# EAGLE design RC-SD2IEC_DJV (EAGLE 6.6.0)
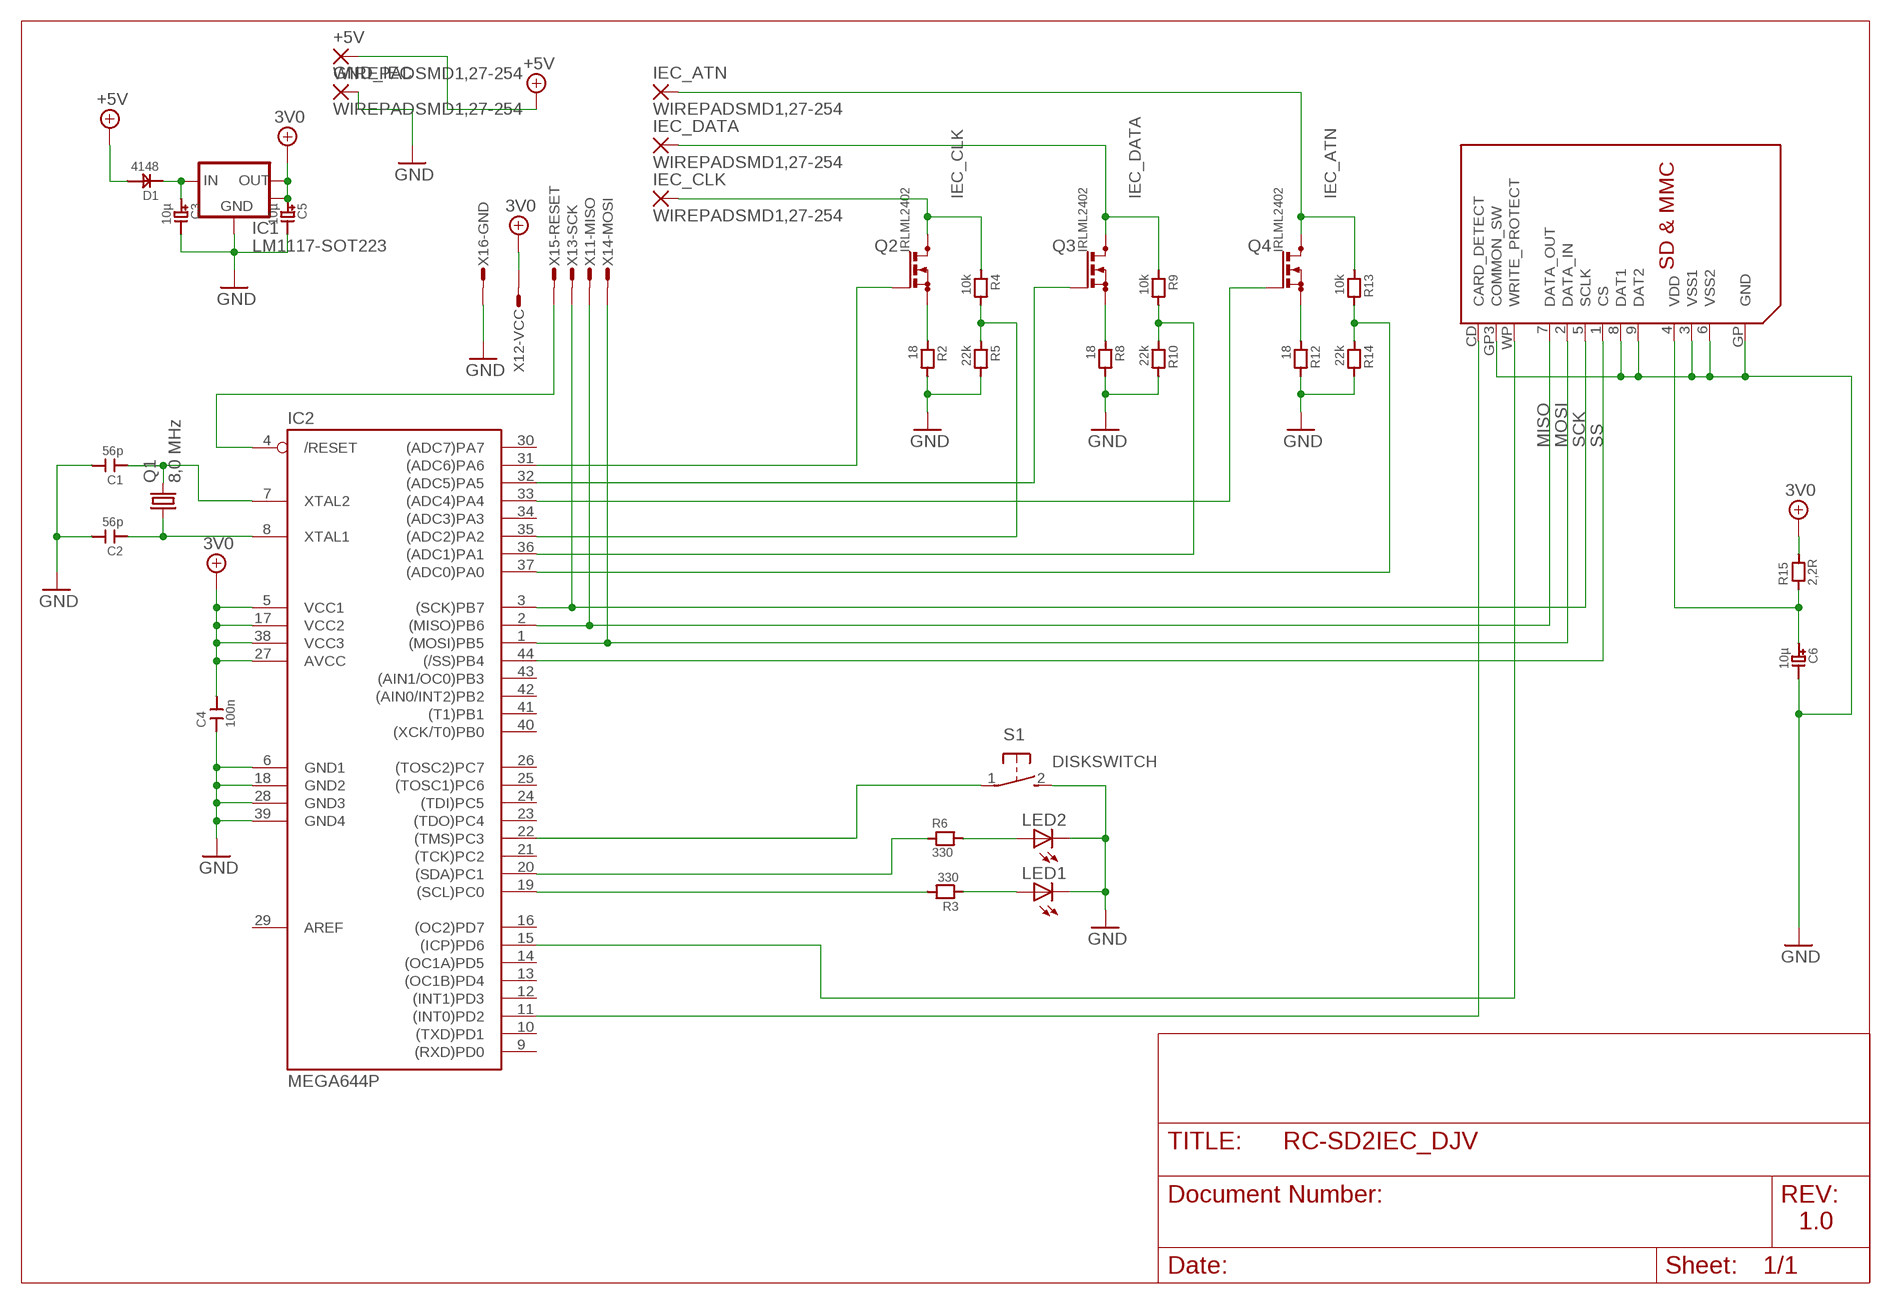
[diagram p0: schematic, sheet 1]

## Parts
+5V  WIREPADSMD1,27-254  [SMD1,27-2,54]
C1  56p  C0805  [C0805]
C2  56p  C0805  [C0805]
C3  10µ  C_POLTA_A  [C_TANTAL_A]
C4  100n  C1206  [C1206]
C5  10µ  C_POLTA_A  [C_TANTAL_A]
C6  10µ  C_POLTA_A  [C_TANTAL_A]
D1  4148  DSOD-123  [SOD-123]
GND_IEC  WIREPADSMD1,27-254  [SMD1,27-2,54]
IC1  LM1117-SOT223  [SOT-223-3]
IC2  MEGA644P  MEGA16/32TQFP  [TQFP44]
IEC_ATN  WIREPADSMD1,27-254  [SMD1,27-2,54]
IEC_CLK  WIREPADSMD1,27-254  [SMD1,27-2,54]
IEC_DATA  WIREPADSMD1,27-254  [SMD1,27-2,54]
LED1  LED3MM  [LED3MM]
LED2  LED3MM  [LED3MM]
Q1  8,0 MHz  CRYSTALCTS406  [CTS406]
Q2  IRLML2402  BSN20_C  [SOT23_C]
Q3  IRLML2402  BSN20_C  [SOT23_C]
Q4  IRLML2402  BSN20_C  [SOT23_C]
R2  18  R0805  [R0805]
R3  330  R0805  [R0805]
R4  10k  R0805  [R0805]
R5  22k  R0805  [R0805]
R6  330  R0805  [R0805]
R8  18  R0805  [R0805]
R9  10k  R0805  [R0805]
R10  22k  R0805  [R0805]
R12  18  R0805  [R0805]
R13  10k  R0805  [R0805]
R14  22k  R0805  [R0805]
R15  2,2R  R0805  [R0805]
S1  31-XX  [B3F-31XX]
SDMMC1  SDMMC06132  [06132]
X1  AVR-ISP_1X6  [1X6_ISP]

## Nets
3V0: C4.2 C5.1 IC1.2(VOUT) IC1.4(HEATSINK) IC2.5(VCC1) IC2.17(VCC2) IC2.27(AVCC) IC2.38(VCC3) R15.2 X1.2
+5V: +5V.1(P) D1.2
/RESET: IC2.4(/RESET) X1.5
ATN: IC2.37((ADC0)PA0) R13.2 R14.1
CD: IC2.11((INT0)PD2) SDMMC1.CD(CARD_DETECT)
CLK: IC2.35((ADC2)PA2) R4.2 R5.1
DATA: IC2.36((ADC1)PA1) R9.2 R10.1
DISKSWITCH: IC2.22((TMS)PC3) S1.1(P)
GND: C1.2 C2.2 C3.2 C4.1 C5.2 C6.2 GND_IEC.1(P) IC1.1(GND) IC2.6(GND1) IC2.18(GND2) IC2.28(GND3) IC2.39(GND4) LED1.K(C) LED2.K(C) R2.2 R5.2 R8.2 R10.2 R12.2 R14.2 S1.2(S) SDMMC1.3(VSS1) SDMMC1.6(VSS2) SDMMC1.8(DAT1) SDMMC1.9(DAT2) SDMMC1.GP3(COMMON_SW) SDMMC1.GP(GND) X1.6
IEC_ATN: IEC_ATN.1(P) Q4.3(D) R13.1
IEC_CLK: IEC_CLK.1(P) Q2.3(D) R4.1
IEC_DATA: IEC_DATA.1(P) Q3.3(D) R9.1
LED1: LED2.A R6.2
LED2: LED1.A R3.1
MISO: IC2.2((MISO)PB6) SDMMC1.7(DATA_OUT) X1.1
MOSI: IC2.1((MOSI)PB5) SDMMC1.2(DATA_IN) X1.4
N$2: C3.1 D1.1 IC1.3(VIN)
N$4: C2.1 IC2.8(XTAL1) Q1.1
N$5: C1.1 IC2.7(XTAL2) Q1.3
N$17: IC2.32((ADC5)PA5) Q3.1(G)
N$19: IC2.33((ADC4)PA4) Q4.1(G)
N$20: IC2.31((ADC6)PA6) Q2.1(G)
N$23: Q2.2(S) R2.1
N$24: Q3.2(S) R8.1
N$25: Q4.2(S) R12.1
PC0: IC2.19((SCL)PC0) R3.2
PC1: IC2.20((SDA)PC1) R6.1
SCK: IC2.3((SCK)PB7) SDMMC1.5(SCLK) X1.3
SS: IC2.44((/SS)PB4) SDMMC1.1(CS)
VDD: C6.1 R15.1 SDMMC1.4(VDD)
WP: IC2.15((ICP)PD6) SDMMC1.WP(WRITE_PROTECT)
Unconnected: IC2.9((RXD)PD0) IC2.10((TXD)PD1) IC2.12((INT1)PD3) IC2.13((OC1B)PD4) IC2.14((OC1A)PD5) IC2.16((OC2)PD7) IC2.21((TCK)PC2) IC2.23((TDO)PC4) IC2.24((TDI)PC5) IC2.25((TOSC1)PC6) IC2.26((TOSC2)PC7) IC2.29(AREF) IC2.30((ADC7)PA7) IC2.34((ADC3)PA3) IC2.40((XCK/T0)PB0) IC2.41((T1)PB1) IC2.42((AIN0/INT2)PB2) IC2.43((AIN1/OC0)PB3)

## Notes on the sheet
- 1.0

## Library data of the parts
+5V GND_IEC IEC_ATN IEC_CLK IEC_DATA = wirepad:WIREPAD: Wire PAD connect wire on PCB
C1 C2 C4 = 0_rr:C
C3 C5 C6 = 0_rr:C_POL
D1 = 0_rr:D
IC1 = bt_regulator:LM1117: LDO Voltage Regulator NCP1117 series are low dropout positive voltage regulators that are capable of providing an output current that is in excess of 1.0 A with a maximum dropout voltage of 1.2 V at 800 mA over temperature. This series contains nine fixed output voltages of 1.5 V, 1.8 V, 1.9 V, 2.0 V, 2.5 V, 2.85 V, 3.3 V, 5.0 V, and 12 V that have no minimum load requirement to maintain regulation. Also included is an adjustable output version that can be programmed from 1.25 V to 18.8 V with two external resistors. datasheet.pdf <http://www.onsemi.com/pub_link/Collateral/NCP1117-D.PDF> LM1117-N is a series of low dropout voltage regulators of 1.2V at 800mA of load current. It has the same pin-out as Texas Instruments' industry standard LM317. The LM1117-N is available in an adjustable version, available in five fixed voltages, 1.8V, 2.5V, 2.85V, 3.3V, and 5V. The LM1117-N offers current limiting and thermal shutdown. Its circuit includes a zener trimmed to within ±1%. datasheet.pdf <http://www.ti.com/lit/ds/symlink/lm1117-n.pdf>
IC2 = 0_rr:MEGA16/32: MICROCONTROLLER 16 Kbytes FLASH, 512 bytes EEPROM 1 Kbytes SRAM dual UART hardware multiplier
LED1 LED2 = led:LED: LED OSRAM: - CHIPLED LG R971, LG N971, LY N971, LG Q971, LY Q971, LO R971, LY R971 LH N974, LH R974 LS Q976, LO Q976, LY Q976 LO Q996 - Hyper CHIPLED LW Q18S LB Q993, LB Q99A, LB R99A - SideLED LS A670, LO A670, LY A670, LG A670, LP A670 LB A673, LV A673, LT A673, LW A673 LH A674 LY A675 LS A676, LA A676, LO A676, LY A676, LW A676 LS A679, LY A679, LG A679 - Hyper Micro SIDELED® LS Y876, LA Y876, LO Y876, LY Y876 LT Y87S - SmartLED LW L88C, LW L88S LB L89C, LB L89S, LG L890 LS L89K, LO L89K, LY L89K LS L896, LA L896, LO L896, LY L896 - TOPLED LS T670, LO T670, LY T670, LG T670, LP T670 LSG T670, LSP T670, LSY T670, LOP T670, LYG T670 LG T671, LOG T671, LSG T671 LB T673, LV T673, LT T673, LW T673 LH T674 LS T676, LA T676, LO T676, LY T676, LB T676, LH T676, LSB T676, LW T676 LB T67C, LV T67C, LT T67C, LS T67K, LO T67K, LY T67K, LW E67C LS E67B, LA E67B, LO E67B, LY E67B, LB E67C, LV E67C, LT E67C LW T67C LS T679, LY T679, LG T679 LS T770, LO T770, LY T770, LG T770, LP T770 LB T773, LV T773, LT T773, LW T773 LH T774 LS E675, LA E675, LY E675, LS T675 LS T776, LA T776, LO T776, LY T776, LB T776 LHGB T686 LT T68C, LB T68C - Hyper Mini TOPLED® LB M676 - Mini TOPLED Santana® LG M470 LS M47K, LO M47K, LY M47K Source: http://www.osram.convergy.de LUXEON: - LUMILED® LXK2-PW12-R00, LXK2-PW12-S00, LXK2-PW14-U00, LXK2-PW14-V00 LXK2-PM12-R00, LXK2-PM12-S00, LXK2-PM14-U00 LXK2-PE12-Q00, LXK2-PE12-R00, LXK2-PE12-S00, LXK2-PE14-T00, LXK2-PE14-U00 LXK2-PB12-K00, LXK2-PB12-L00, LXK2-PB12-M00, LXK2-PB14-N00, LXK2-PB14-P00, LXK2-PB14-Q00 LXK2-PR12-L00, LXK2-PR12-M00, LXK2-PR14-Q00, LXK2-PR14-R00 LXK2-PD12-Q00, LXK2-PD12-R00, LXK2-PD12-S00 LXK2-PH12-R00, LXK2-PH12-S00 LXK2-PL12-P00, LXK2-PL12-Q00, LXK2-PL12-R00 Source: www.luxeon.com KINGBRIGHT: KA-3528ASYC Source: www.kingbright.com
Q1 = adafruit:CRYSTAL: CRYSTAL; OC_FARNELL: unknown; OC_NEWARK: unknown
Q2-Q4 = 0_rr:BSN20: N-CHANNEL MOS FET
R2-R6 R8-R10 R12-R15 = 0_rr:R
S1 = switch-omron:31-XX: OMRON SWITCH
SDMMC1 = adafruit:SDMMC: SD MMC Card holder 4UCON part #06132 - easy to solder
X1 = 0_rr:AVR-ISP: MicroMaTch 6 7-215464-6 / 0-215464-6 Drawing Number C-215464 DDEController.pdf

## Board
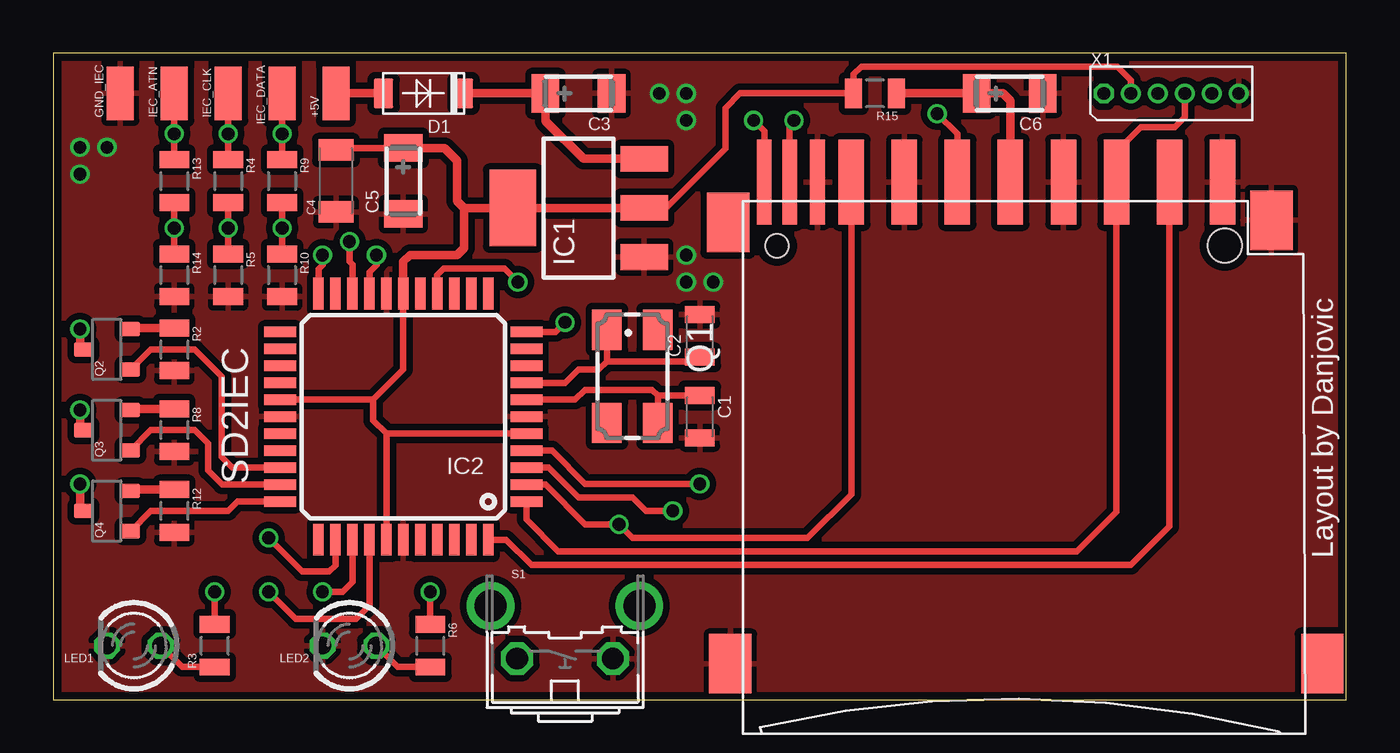
[diagram p1: board, top side]
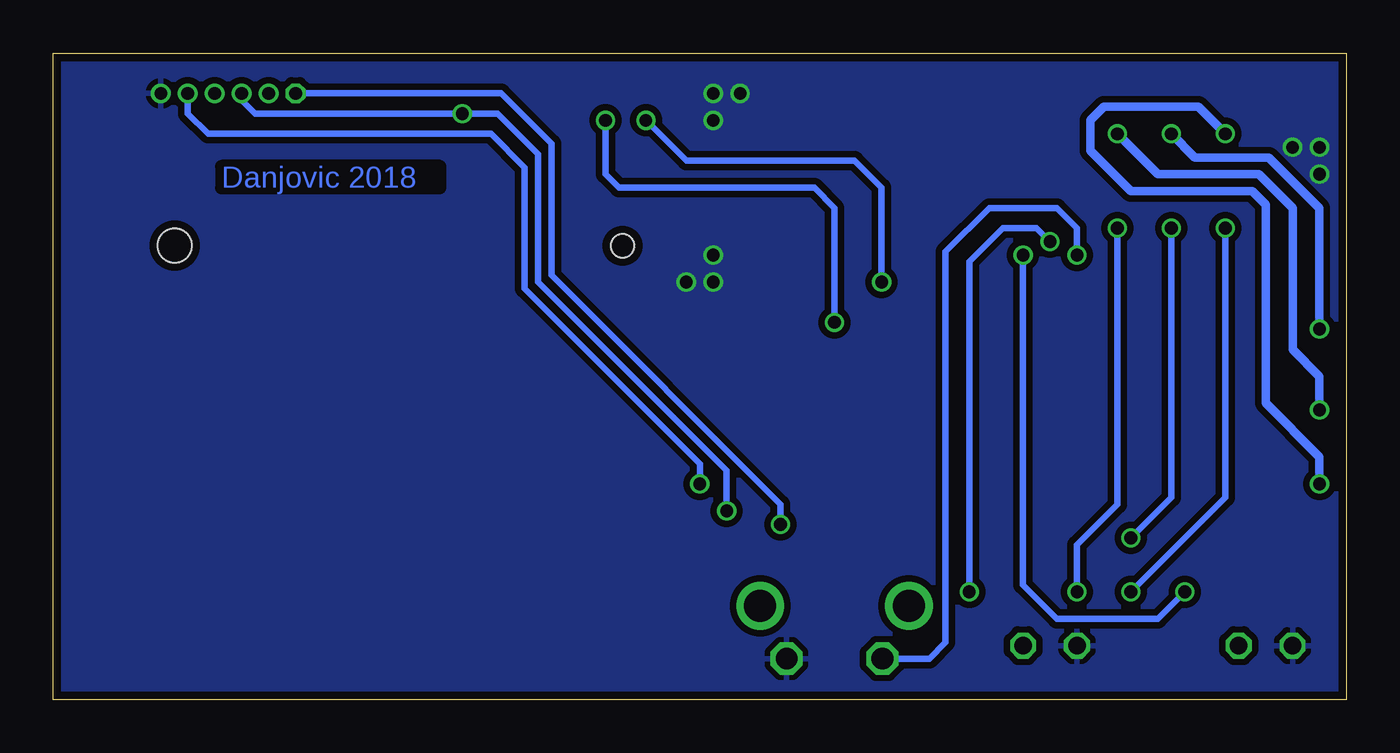
[diagram p2: board, bottom side, seen from below]

Size 60.96 x 30.48 mm. Coordinates in mm from the lower left corner, seen from the top.
Outline: 0,0 60.96,0 60.96,30.48 0,30.48 0,0
Copper layers (1*16): Top 0.035559375mm / dielectric 1.6mm / Bottom 0.035559375mm
Design rules "oshpark-2layer *": minimum track width 6mil, minimum drill 10mil, track to track 6mil, track to pad 6mil, pad to pad 6mil, via to via 6mil, smd to smd 6mil, copper to edge 15mil, drill to drill 6mil, minimum pad ring 5mil, minimum via ring 5mil, stop-mask expansion 2.5mil, vias tented up to drill 0mil, thermal gap 10mil

### Footprints (pad centres in the part's own frame; a part is rotated, then mirrored left to right if it is on the bottom)
SMD1,27-2,54 = smd 1.27 x 2.54: 1 0,0
C0805 = smd 0.8 x 1.4: 1 -1,0; 2 1,0
C_TANTAL_A = smd 1.3 x 1.8: 1 1.559,0; 2 -1.559,0
C1206 = smd 1.016 x 1.651: 1 -1.462,0; 2 1.462,0
SOD-123 = smd 0.914 x 1.397: 1 -1.884,0; 2 1.884,0
SOT-223-3 = smd 1.219 x 2.235: 1 -2.311,-3.099; 2 0,-3.099; 3 2.311,-3.099 | smd 3.6 x 2.2: 4 0,3.099
TQFP44 = smd 1.5 x 0.5: 1 -5.8,4; 2 -5.8,3.2; 3 -5.8,2.4; 4 -5.8,1.6; 5 -5.8,0.8; 6 -5.8,0; 7 -5.8,-0.8; 8 -5.8,-1.6; 9 -5.8,-2.4; 10 -5.8,-3.2; 11 -5.8,-4; 23 5.8,-4; 24 5.8,-3.2; 25 5.8,-2.4; 26 5.8,-1.6; 27 5.8,-0.8; 28 5.8,0; 29 5.8,0.8; 30 5.8,1.6; 31 5.8,2.4; 32 5.8,3.2; 33 5.8,4 | smd 0.5 x 1.5: 12 -4,-5.8; 13 -3.2,-5.8; 14 -2.4,-5.8; 15 -1.6,-5.8; 16 -0.8,-5.8; 17 0,-5.8; 18 0.8,-5.8; 19 1.6,-5.8; 20 2.4,-5.8; 21 3.2,-5.8; 22 4,-5.8; 34 4,5.8; 35 3.2,5.8; 36 2.4,5.8; 37 1.6,5.8; 38 0.8,5.8; 39 0,5.8; 40 -0.8,5.8; 41 -1.6,5.8; 42 -2.4,5.8; 43 -3.2,5.8; 44 -4,5.8
LED3MM = drill 0.813 octagon: A -1.27,0; K 1.27,0
CTS406 = smd 1.9 x 1.4: 1 -2.2,-1.2; 2 2.2,-1.2; 3 2.2,1.2; 4 -2.2,1.2
SOT23_C = smd 0.7 x 0.9: 1 -0.953,-1.111; 2 0.953,-1.111; 3 0,1.111
R0805 = smd 0.8 x 1.4: 1 -1.009,0; 2 1.009,0
B3F-31XX = drill 1.016 octagon: 1 -2.261,-1.245; 2 2.261,-1.245 | drill 1.499 pad 2.159: 3 -3.505,1.245; 4 3.505,1.245
06132 = smd 1.2 x 4: 1 6.9,0.9; 2 4.4,0.9; 3 1.9,0.9; 4 -0.6,0.9; 5 -3.1,0.9; 6 -5.6,0.9; 7 -8.1,0.9; 9 9.4,0.9 | smd 0.7 x 4: 8 -9.7,0.9; CD -11,0.9; WP -12.2,0.9 | smd 2 x 2.8: GP -13.8,-21.8; GP2 14.1,-21.8; GP3 11.7,-0.9; GP4 -13.9,-1 | hole 1.1: -11.6,-2.1 | hole 1.6: 9.5,-2.1
1X6_ISP = drill 0.6 pad 0.94 octagon: 1 0,0 | drill 0.6 pad 0.94: 2 1.27,0; 3 2.54,0; 4 3.81,0; 5 5.08,0; 6 6.35,0

### Placement (x,y rotation side)
+5V  13.34,28.57 0 top
C1  30.48,13.34 270 top
C2  30.48,17.14 90 top
C3  24.77,28.57 180 top
C4  13.34,24.45 90 top
C5  16.51,24.45 90 top
C6  45.09,28.57 180 top
D1  17.46,28.57 180 top
GND_IEC  3.17,28.57 0 top
IC1  24.77,23.18 90 top
IC2  16.51,13.34 180 top
IEC_ATN  5.71,28.57 0 top
IEC_CLK  8.26,28.57 0 top
IEC_DATA  10.79,28.57 0 top
LED1  3.81,2.54 180 top
LED2  13.97,2.54 180 top
Q1  27.3,15.24 270 top
Q2  2.54,16.51 90 top
Q3  2.54,12.7 90 top
Q4  2.54,8.89 90 top
R2  5.71,16.51 270 top
R3  7.62,2.54 90 top
R4  8.26,24.45 270 top
R5  8.26,20 270 top
R6  17.78,2.54 270 top
R8  5.71,12.7 270 top
R9  10.79,24.45 270 top
R10  10.79,20 270 top
R12  5.71,8.89 270 top
R13  5.71,24.45 270 top
R14  5.71,20 270 top
R15  38.73,28.57 180 top
S1  24.13,3.17 0 top
SDMMC1  45.72,23.5 0 top
X1  49.53,28.57 0 top

### Tracks (layer width: path | path; a pad name or v marks a point on that pad's centre or on a via)
3V0
  Top 0.305: X1.2 50.8,29.21 50.16,29.84 38.1,29.84 37.73,29.47 R15.2 32.38,28.57 31.69,27.88 31.69,25.98 28.89,23.18 IC1.2 | IC2.17 16.51,15.56 15.09,14.13 | IC2.27 15.09,14.13 | IC2.5 15.71,12.54 | 15.71,12.54 IC2.38 | 15.71,12.54 15.09,13.16 15.09,14.13 | C5.1 13.34,26.01 C4.2
  Top 0.406: IC1.2 IC1.4 19.37,23.18 | 19.37,23.18 19.05,23.5 19.05,25.4 18.44,26.01 C5.1 | IC2.17 16.51,20.64 16.83,20.95 19.05,20.95 19.37,21.27 19.37,23.18
+5V
  Top 0.406: +5V.1 D1.2
/RESET  (via drill 0.6)
  Top 0.305: IC2.4 23.51,11.73 25.08,10.16 v30.48,10.16
  Bottom 0.305: X1.5 54.61,27.62 53.66,26.67 40.32,26.67 38.73,25.08 38.73,19.37 30.48,11.11 v30.48,10.16
ATN  (via drill 0.6)
  Top 0.305: R13.2 v5.71,22.23 R14.1 | IC2.37 14.91,4.43 14.29,3.81 11.43,3.81 v10.16,5.08
  Bottom 0.305: v10.16,5.08 5.71,9.53 v5.71,22.23
CD  (via drill 0.6)
  Top 0.305: IC2.11 23.68,17.34 v24.13,17.78 | SDMMC1.CD 34.72,27.1 v34.92,27.3
  Bottom 0.305: v24.13,17.78 24.13,23.18 25.08,24.13 34.29,24.13 34.92,24.77 v34.92,27.3
CLK  (via drill 0.6)
  Top 0.305: R4.2 v8.26,22.23 R5.1 | IC2.35 13.31,6.33 13.02,6.03 11.75,6.03 v10.16,7.62
  Bottom 0.305: v10.16,7.62 8.26,9.53 v8.26,22.23
DATA  (via drill 0.6)
  Top 0.305: R9.2 v10.79,22.23 R10.1 | v12.7,5.08 13.65,5.08 14.11,5.54 IC2.36
  Bottom 0.305: v12.7,5.08 12.7,7.3 10.79,9.21 v10.79,22.23
DISKSWITCH  (via drill 0.6)
  Top 0.305: IC2.22 12.51,20.29 12.7,20.48 v12.7,20.95
  Bottom 0.305: S1.1 19.66,1.93 18.89,2.7 18.89,21.11 16.83,23.18 13.65,23.18 12.7,22.23 v12.7,20.95
GND  (via drill 0.6)
  other vias: 29.84,28.57 29.84,20.95 29.84,19.68 31.11,19.68 1.27,26.04 1.27,24.77 29.84,27.3 28.57,28.57 2.54,26.04
  pour Top (isolate 0.305): 0,0 62.23,0 62.23,30.48 0,30.48
  pour Bottom (isolate 0.305): 0,0 62.55,0 62.55,30.48 0,30.48
IEC_ATN  (via drill 0.6)
  Top 0.305: IEC_ATN.1 v5.71,26.67 R13.1
  Top 0.406: Q4.3 1.27,9.05 v1.27,10.16
  Bottom 0.406: v5.71,26.67 6.99,27.94 11.43,27.94 12.06,27.3 12.06,25.88 10.16,23.97 4.45,23.97 3.81,23.34 3.81,13.97 1.27,11.43 v1.27,10.16
IEC_CLK  (via drill 0.6)
  Top 0.305: IEC_CLK.1 v8.26,26.67 R4.1
  Top 0.406: Q2.3 1.27,16.51 v1.27,17.46
  Bottom 0.406: v1.27,17.46 1.27,23.18 3.65,25.56 7.14,25.56 v8.26,26.67
IEC_DATA  (via drill 0.6)
  Top 0.305: IEC_DATA.1 v10.79,26.67 R9.1
  Top 0.406: Q3.3 1.27,12.86 v1.27,13.65
  Bottom 0.406: v1.27,13.65 1.27,15.24 2.54,16.51 2.54,23.18 4.13,24.77 8.89,24.77 v10.79,26.67
LED1
  Top 0.305: R6.2 16.25,1.53 LED2.A
LED2
  Top 0.305: R3.1 6.09,1.53 LED1.A
MISO  (via drill 0.6)
  Top 0.305: IC2.2 23.2,10.13 25.08,8.26 v26.67,8.26 27.3,7.62 35.56,7.62 37.62,9.68 SDMMC1.7
  Bottom 0.305: X1.1 39.84,28.57 37.47,26.2 37.47,20 26.67,9.21 v26.67,8.26
MOSI
  Top 0.305: X1.4 53.34,27.46 52.86,26.99 51.28,26.99 50.12,25.83 SDMMC1.2 50.12,8.85 48.26,6.99 23.81,6.99 22.31,8.49 IC2.1
N$2
  Top 0.406: D1.1 C3.1 23.21,27.28 24.99,25.49 IC1.3
N$4
  Top 0.254: C2.1 30.28,15.95
  Top 0.305: Q1.1 26.11,15.95 | 30.28,15.95 26.11,15.95 | IC2.8 24.14,14.94 24.77,15.56 25.72,15.56 26.11,15.95
N$5
  Top 0.305: C1.1 28.5,14.34 | 28.5,14.34 Q1.3 | 28.5,14.34 28.23,14.61 25.08,14.61 24.61,14.13 IC2.7
N$17
  Top 0.305: Q3.1 4.6,12.7 6.67,12.7 7.3,12.06 7.3,10.79 7.96,10.13 IC2.32
N$19
  Top 0.305: IC2.33 8.7,9.34 8.26,8.89 4.6,8.89 Q4.1
N$20
  Top 0.305: IC2.31 8.43,10.94 7.94,11.43 7.94,15.24 6.67,16.51 4.6,16.51 Q2.1
N$23
  Top 0.406: R2.1 3.71,17.52 Q2.2
N$24
  Top 0.406: R8.1 3.71,13.71 Q3.2
N$25
  Top 0.406: R12.1 3.71,9.9 Q4.2
PC0  (via drill 0.6)
  Top 0.305: R3.2 v7.62,5.08 | IC2.19 14.91,20.15 15.24,20.48 v15.24,20.95
  Bottom 0.305: v7.62,5.08 8.89,3.81 13.65,3.81 15.24,5.4 v15.24,20.95
PC1  (via drill 0.6)
  Top 0.305: R6.1 v17.78,5.08 | IC2.20 14.11,20.5 13.97,20.64 v13.97,21.59
  Bottom 0.305: v17.78,5.08 17.78,20.64 16.19,22.23 14.61,22.23 v13.97,21.59
SCK  (via drill 0.6)
  Top 0.305: IC2.3 23.36,10.94 24.77,9.53 27.3,9.53 27.94,8.89 v29.21,8.89 | SDMMC1.5 42.62,26.67 v41.67,27.62
  Bottom 0.305: v29.21,8.89 29.21,10.79 38.1,19.68 38.1,25.72 40.01,27.62 v41.67,27.62 51.44,27.62 52.07,28.26 X1.3
SS
  Top 0.305: SDMMC1.1 52.62,8.17 50.8,6.35 22.54,6.35 21.36,7.54 IC2.44
VDD
  Top 0.406: R15.1 C6.1 44.77,28.57 45.12,28.22 SDMMC1.4
WP  (via drill 0.6)
  Top 0.305: IC2.15 18.11,20.02 18.41,20.32 21.27,20.32 v21.91,19.68 | SDMMC1.WP 33.52,26.8 v33.02,27.3
  Bottom 0.305: v33.02,27.3 31.11,25.4 23.18,25.4 21.91,24.13 v21.91,19.68

### Text on the board
Bottom: Danjovic 2018
tPlace: SD2IEC | Layout by Danjovic